# Altium project PROC154E3_SCH.PrjPcb (part 54 of 60)

## Sheet 56. SOC LDOs & LD SWITCHES.SchDoc: SOC - LDO's
size 513 x 386 mm; Project: PROC154E2(001)_SK_AM69; Issue: 1.0; RevCode: E3; Page Create Date: March  8, 1995; Variant Name: Core Design; Schematic Page Number: 56; Page Number: 56; Page Size: C; Comment: MISTRAL_TITLEBLK_CSIZE_1; Page Count: 62; Schematic Page Count: 62; Name: PROC154E2 001 SK AM69; DsnPath: C:\Users\danie\Downloads\sprr466c\PROC154E3_RP\PROC154E3_SCH.DSN; SchematicName: SCHEMATIC1; PageName: 56. SOC LDOs & LD SWITCHES; PageSize: C; TopSchematic: True
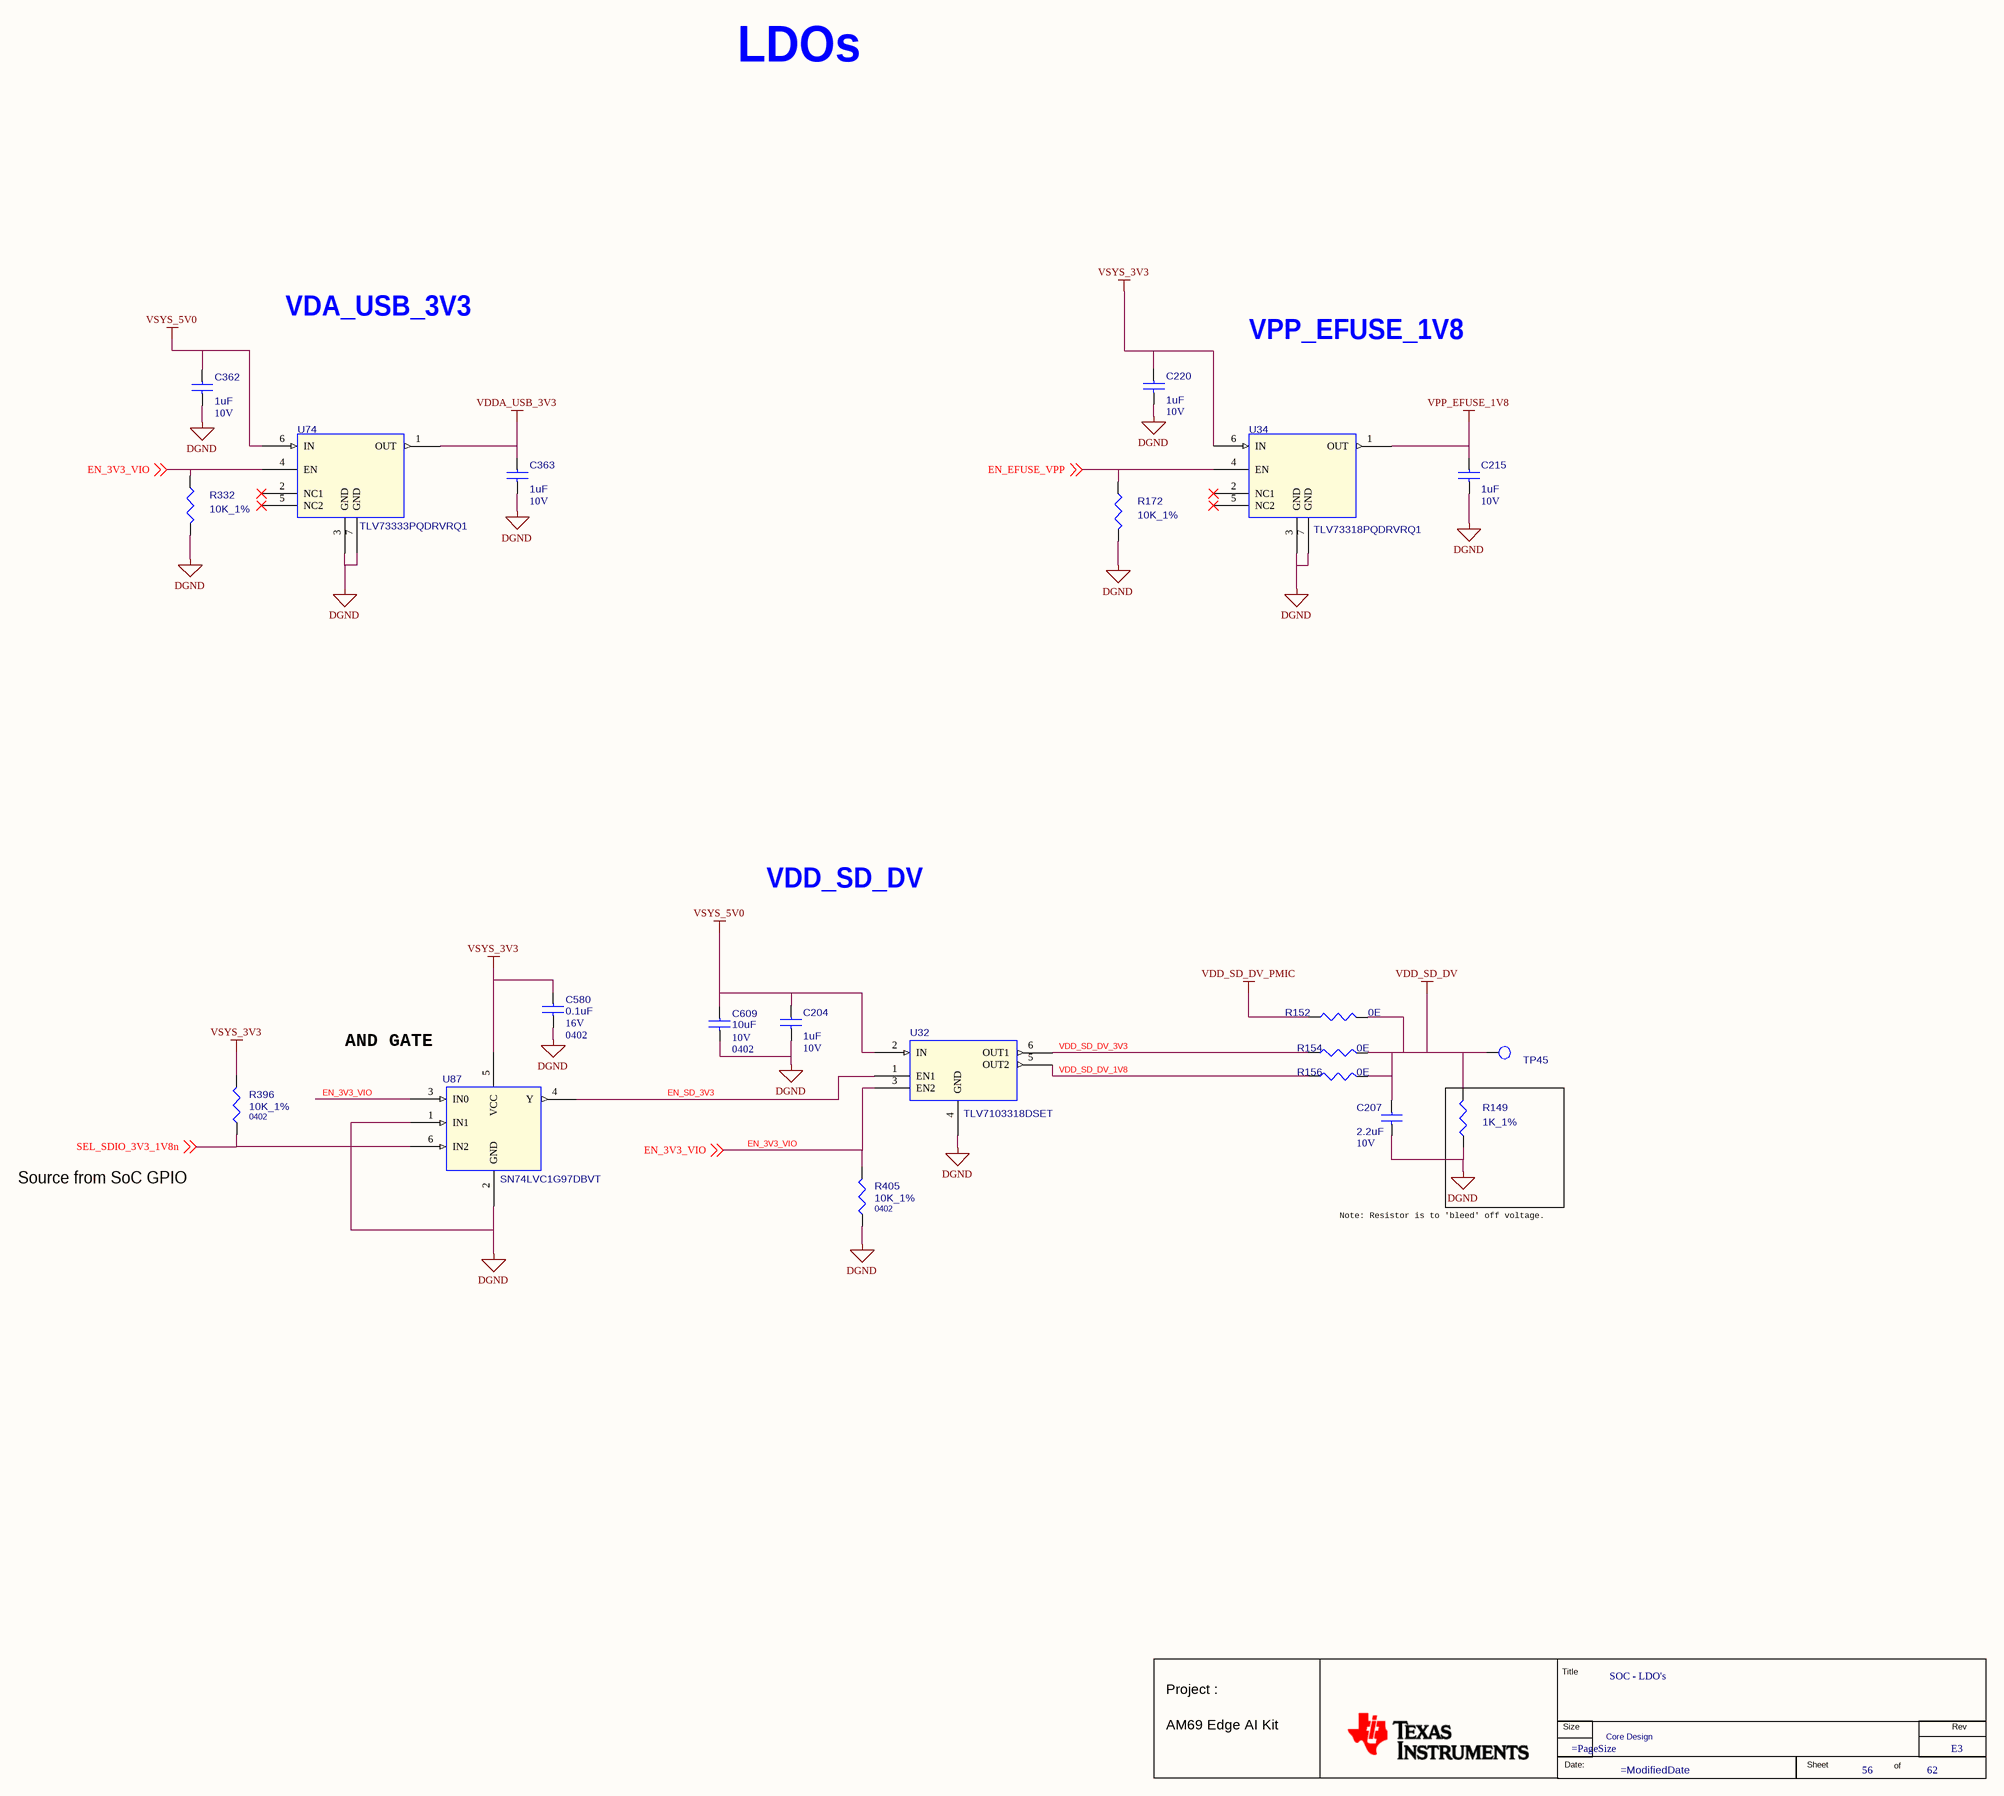
[diagram p94: 56. SOC LDOs & LD SWITCHES.SchDoc]

### Parts
(Parts that share a designator on the sheet are numbered #1, #2 ... from top to bottom, then left to right.)
*#56  RevCode: E3  Title: SOC - LDO's  Page Number: 56  Page Count: 62  Variant Name: Core Design  (hidden comment: MISTRAL_TITLEBLK_CSIZE_1)  (graphical)
C204  1uF  Voltage: 10V  [CAP0402_0-75]
C207  2.2uF  Voltage: 10V  [CAP0603_1]
C215  1uF  Voltage: 10V  [CAP0402_0-75]
C220  1uF  Voltage: 10V  [CAP0402_0-75]
C362  1uF  Voltage: 10V  [CAP0402_0-75]
C363  1uF  Voltage: 10V  [CAP0402_0-75]
C580  0.1uF  Voltage: 16V  Package: 0402  [CAP0402_0-75]
C609  10uF  Voltage: 10V  Package: 0402  [CAP0402_0-75]
R149  1K_1%  [RES0402_0-5]
R152  0E  [RES0402_0-5]
R154  0E  [RES0402_0-5]
R156  0E  [RES0402_0-5]
R172  10K_1%  [RES0402_0-5]
R332  10K_1%  [RES0402_0-5]
R396  10K_1%  Package: 0402  [RES0402_0-5]
R405  10K_1%  Package: 0402  [RES0402_0-5]
TP45  TP30_SMD  [TP30_SMD]  (value not drawn)
U32  TLV7103318DSET  [WSON6_19-68_60X60]
U34  TLV73318PQDRVRQ1  [SON6_25-59_85X85_0-8]
U74  TLV73333PQDRVRQ1  [SON6_25-59_85X85_0-8]
U87  SN74LVC1G97DBVT  [SOT23-6]

### Nets
DGND: C204.2 C207.2 C215.2 C220.2 C362.2 C363.2 C580.2 C609.2 R149.1 R172.2 R332.2 R405.1 U32.4(GND) U34.3(GND) U34.7(GND) U74.3(GND) U74.7(GND) U87.1(IN1) U87.2(GND)  [project net VDD_CPU_HCPS_GOSNS]
VDD_SD_DV: C207.1 R149.2 R152.1 R154.2 R156.2 TP45.1(TP)
VDD_SD_DV_PMIC: R152.2
VDDA_USB_3V3: C363.1 U74.1(OUT)
VPP_EFUSE_1V8: C215.1 U34.1(OUT)
VSYS_3V3: C220.1 C580.1 R396.2 U34.6(IN) U87.5(VCC)  [project net V_3V3]
VSYS_5V0: C204.1 C362.1 C609.1 U32.2(IN) U74.6(IN)
EN_3V3_VIO: R332.1 R405.2 U32.3(EN2) U74.4(EN) U87.3(IN0) ; off-sheet EN_3V3_VIO
EN_EFUSE_VPP: R172.1 U34.4(EN) ; off-sheet EN_EFUSE_VPP
EN_SD_3V3: U32.1(EN1) U87.4(Y)
SEL_SDIO_3V3_1V8n: R396.1 U87.6(IN2) ; off-sheet SEL_SDIO_3V3_1V8n
VDD_SD_DV_1V8: R156.1 U32.5(OUT2)
VDD_SD_DV_3V3: R154.1 U32.6(OUT1)

Not connected (* = marked no-connect by the designer): U34 2(NC1)* 5(NC2)*; U74 2(NC1)* 5(NC2)*

### Notes on the sheet
- LDOs
- VDA_USB_3V3
- VPP_EFUSE_1V8
- VDD_SD_DV
- (near U87) AND GATE
- Source from SoC GPIO
- Note: Resistor is to 'bleed' off voltage.
- (in symbol MISTRAL_TITLEBLK_CSIZE_1) Title; Project :; Size; Rev; AM69 Edge AI Kit; Date:; Sheet; of

### Library data of the parts
*#56 = MISTRAL_TITLEBLK_CSIZE_1: Issue: 1.0; Project: PROC154E2(001)_SK_AM69; Name: PROC154E2 001 SK AM69; Page Create Date: March  8, 1995; Page Size: =PageSize; Page Modify Date: =ModifiedDate; Schematic Page Count: 62; Schematic Page Number: 56
C204 = CAP_Dup1: CAP CERAMIC 1uF 10V 10% X7S AUTO 0402; Part Reference: C204; Mistral Part No: 120018090021-R; Mfr_name: MURATA; Mfr_part_number: GCM155C71A105KE38D; Part_type: CAPACITORS\CERAMIC; Direct Alternate_mfr_name: YAGEO AMERICA; Direct Alternate_mfr_part_number: CC0402KRX5R7BB105; Automotive Alternate_mfr_name: TAIYO YUDEN; Automotive Alternate_mfr_part_number: EMK105BJ105KVHF; Manufacturer: TDK CORPORATION; Project: SMART-M_SCRIPTALK_PB; Wattage: NA; Customs_HS_Code: 85322990; Custom_Duty: 15%; Value: 1uF; PCB Footprint: CAP0402_0-75; Footprint Path: Y:\MIS_DATABASE\Library\ALTIUM_TOOL\PCB_FOOTPRINTS\Altium_Footprint_Lib.PcbLib; Library Path: Y:\MIS_DATABASE\Library\ALTIUM_TOOL\SCHEMATICS_PARTS\MS_DISCRETE_Library.schlib; Footprint Ref: CAP0402_0-75; Tolerance: 10%; Package: 0402; Distributor_name: DIGIKEY; Distributor_part_number: 490-13409-1-ND; Height: 0.70MM; Weight: 6mg; Temperature: -55°C+125°C; Datasheet: Y:\MIS_DATABASE\DATASHEETS\CAPACITORS\MURATA-GCM-SER.PDF; Crtd /date: ALVY/100918; Chkd/date: MANIRAJA/100918; Library Ref: CAP; MECHANICAL 3D STEP FILE: CAP0402_0-75
C207 = CAP_Dup1: CAP CERAMIC 2.2uF 10V 10% X7S 0603; Part Reference: C207; Manufacturer: MURATA; Automotive Alternate_mfr_part_number: LMK105ABJ225MVHF; Automotive Alternate_mfr_name: TAIYO YUDEN; Direct Alternate_mfr_part_number: C1005X5R1A225K050BC; Direct Alternate_mfr_name: TDK; Part_type: CAPACITORS\CERAMIC; Mfr_part_number: GCM188C71A225KE01; Mistral Part No: 120022090022-R; Custom_Duty: 15%; Customs_HS_Code: 85322990; Wattage: NA; Project: J7AHP_SK_BRD; Value: 2.2uF; PCB Footprint: CAP0603_1; Footprint Path: Y:\MIS_DATABASE\Library\ALTIUM_TOOL\PCB_FOOTPRINTS\Altium_Footprint_Lib.PcbLib; Library Path: Y:\MIS_DATABASE\Library\ALTIUM_TOOL\SCHEMATICS_PARTS\MS_DISCRETE_Library.schlib; Footprint Ref: CAP0603_1; Library Ref: CAP; MECHANICAL 3D STEP FILE: CAP0603_1; Chkd/date: PRAVEEN/160922; Crtd /date: PRAVEEN/160922; Datasheet: Y:\MIS_DATABASE\DATASHEETS\CAPACITORS\GCM188C71A225KE01.PDF; Temperature: -55°C+125°C; Weight: 6.3mg; Height: 0.90MM; Distributor_part_number: NA; Distributor_name: NA; Package: 0603; Tolerance: 10%; Mfr_name: MURATA
C215 = CAP_Dup1: CAP CERAMIC 1uF 10V 10% X7S AUTO 0402; Part Reference: C215; Mistral Part No: 120018090021-R; Mfr_name: MURATA; Mfr_part_number: GCM155C71A105KE38D; Part_type: CAPACITORS\CERAMIC; Direct Alternate_mfr_name: YAGEO AMERICA; Direct Alternate_mfr_part_number: CC0402KRX5R7BB105; Automotive Alternate_mfr_name: TAIYO YUDEN; Automotive Alternate_mfr_part_number: EMK105BJ105KVHF; Manufacturer: TDK CORPORATION; Project: SMART-M_SCRIPTALK_PB; Wattage: NA; Customs_HS_Code: 85322990; Custom_Duty: 15%; Value: 1uF; PCB Footprint: CAP0402_0-75; Footprint Path: Y:\MIS_DATABASE\Library\ALTIUM_TOOL\PCB_FOOTPRINTS\Altium_Footprint_Lib.PcbLib; Library Path: Y:\MIS_DATABASE\Library\ALTIUM_TOOL\SCHEMATICS_PARTS\MS_DISCRETE_Library.schlib; Footprint Ref: CAP0402_0-75; Tolerance: 10%; Package: 0402; Distributor_name: DIGIKEY; Distributor_part_number: 490-13409-1-ND; Height: 0.70MM; Weight: 6mg; Temperature: -55°C+125°C; Datasheet: Y:\MIS_DATABASE\DATASHEETS\CAPACITORS\MURATA-GCM-SER.PDF; Crtd /date: ALVY/100918; Chkd/date: MANIRAJA/100918; Library Ref: CAP; MECHANICAL 3D STEP FILE: CAP0402_0-75
C220 = CAP_Dup1: CAP CERAMIC 1uF 10V 10% X7S AUTO 0402; Part Reference: C220; Mistral Part No: 120018090021-R; Mfr_name: MURATA; Mfr_part_number: GCM155C71A105KE38D; Part_type: CAPACITORS\CERAMIC; Direct Alternate_mfr_name: YAGEO AMERICA; Direct Alternate_mfr_part_number: CC0402KRX5R7BB105; Automotive Alternate_mfr_name: TAIYO YUDEN; Automotive Alternate_mfr_part_number: EMK105BJ105KVHF; Manufacturer: TDK CORPORATION; Project: SMART-M_SCRIPTALK_PB; Wattage: NA; Customs_HS_Code: 85322990; Custom_Duty: 15%; Value: 1uF; PCB Footprint: CAP0402_0-75; Footprint Path: Y:\MIS_DATABASE\Library\ALTIUM_TOOL\PCB_FOOTPRINTS\Altium_Footprint_Lib.PcbLib; Library Path: Y:\MIS_DATABASE\Library\ALTIUM_TOOL\SCHEMATICS_PARTS\MS_DISCRETE_Library.schlib; Footprint Ref: CAP0402_0-75; Tolerance: 10%; Package: 0402; Distributor_name: DIGIKEY; Distributor_part_number: 490-13409-1-ND; Height: 0.70MM; Weight: 6mg; Temperature: -55°C+125°C; Datasheet: Y:\MIS_DATABASE\DATASHEETS\CAPACITORS\MURATA-GCM-SER.PDF; Crtd /date: ALVY/100918; Chkd/date: MANIRAJA/100918; Library Ref: CAP; MECHANICAL 3D STEP FILE: CAP0402_0-75
C362 = CAP_Dup1: CAP CERAMIC 1uF 10V 10% X7S AUTO 0402; Part Reference: C362; Manufacturer: TDK CORPORATION; Automotive Alternate_mfr_part_number: EMK105BJ105KVHF; Automotive Alternate_mfr_name: TAIYO YUDEN; Direct Alternate_mfr_part_number: CC0402KRX5R7BB105; Direct Alternate_mfr_name: YAGEO AMERICA; Part_type: CAPACITORS\CERAMIC; Mfr_part_number: GCM155C71A105KE38D; Mfr_name: MURATA; Mistral Part No: 120018090021-R; Custom_Duty: 15%; Customs_HS_Code: 85322990; Wattage: NA; Project: SMART-M_SCRIPTALK_PB; Value: 1uF; PCB Footprint: CAP0402_0-75; MECHANICAL 3D STEP FILE: CAP0402_0-75; Library Ref: CAP; Chkd/date: MANIRAJA/100918; Crtd /date: ALVY/100918; Datasheet: Y:\MIS_DATABASE\DATASHEETS\CAPACITORS\MURATA-GCM-SER.PDF; Temperature: -55°C+125°C; Weight: 6mg; Height: 0.70MM; Distributor_part_number: 490-13409-1-ND; Distributor_name: DIGIKEY; Package: 0402; Tolerance: 10%; Footprint Ref: CAP0402_0-75; Library Path: Y:\MIS_DATABASE\Library\ALTIUM_TOOL\SCHEMATICS_PARTS\MS_DISCRETE_Library.schlib; Footprint Path: Y:\MIS_DATABASE\Library\ALTIUM_TOOL\PCB_FOOTPRINTS\Altium_Footprint_Lib.PcbLib
C363 = CAP_Dup1: CAP CERAMIC 1uF 10V 10% X7S AUTO 0402; Part Reference: C363; Mistral Part No: 120018090021-R; Mfr_name: MURATA; Mfr_part_number: GCM155C71A105KE38D; Part_type: CAPACITORS\CERAMIC; Direct Alternate_mfr_name: YAGEO AMERICA; Direct Alternate_mfr_part_number: CC0402KRX5R7BB105; Automotive Alternate_mfr_name: TAIYO YUDEN; Automotive Alternate_mfr_part_number: EMK105BJ105KVHF; Manufacturer: TDK CORPORATION; Project: SMART-M_SCRIPTALK_PB; Wattage: NA; Customs_HS_Code: 85322990; Custom_Duty: 15%; Value: 1uF; PCB Footprint: CAP0402_0-75; Footprint Path: Y:\MIS_DATABASE\Library\ALTIUM_TOOL\PCB_FOOTPRINTS\Altium_Footprint_Lib.PcbLib; Library Path: Y:\MIS_DATABASE\Library\ALTIUM_TOOL\SCHEMATICS_PARTS\MS_DISCRETE_Library.schlib; Footprint Ref: CAP0402_0-75; Tolerance: 10%; Package: 0402; Distributor_name: DIGIKEY; Distributor_part_number: 490-13409-1-ND; Height: 0.70MM; Weight: 6mg; Temperature: -55°C+125°C; Datasheet: Y:\MIS_DATABASE\DATASHEETS\CAPACITORS\MURATA-GCM-SER.PDF; Crtd /date: ALVY/100918; Chkd/date: MANIRAJA/100918; Library Ref: CAP; MECHANICAL 3D STEP FILE: CAP0402_0-75
C580 = CAP_Dup1: CAP CERAMIC 0.1uF 16V 10% X7R AUTO 0402; Part Reference: C580; Mistral Part No: 120016070006-R; Mfr_name: MURATA; Mfr_part_number: GCM155R71C104KA55D; Part_type: CAPACITORS\CERAMIC; Direct Alternate_mfr_part_number: GCM155R71C104JA55D; Automotive Alternate_mfr_name: TDK; Automotive Alternate_mfr_part_number: CGA2B1X7R1C104K050BC; Project: DCMIST_FPGA_CARD; Wattage: NA; Customs_HS_Code: 85322990; Custom_Duty: 15%; Value: 0.1uF; PCB Footprint: CAP0402_0-75; Footprint Ref: CAP0402_0-75; Tolerance: 10%; Distributor_name: DIGIKEY; Distributor_part_number: 490-4759-1-ND; Library Ref: CAP; Height: 0.55MM; Weight: 6mg; Temperature: -55°C+125°C; Datasheet: Y:\MIS_DATABASE\DATASHEETS\CAPACITORS\MURATA-GCM-SER.PDF; Crtd /date: VASANTHA/300514; Chkd/date: NAVEED/021014; MECHANICAL 3D STEP FILE: CAP0402_0-75; Library Path: Y:\MIS_DATABASE\Library\ALTIUM_TOOL\SCHEMATICS_PARTS\MS_DISCRETE_Library.schlib; Footprint Path: Y:\MIS_DATABASE\Library\ALTIUM_TOOL\PCB_FOOTPRINTS\Altium_Footprint_Lib.PcbLib; Direct Alternate_mfr_name: MURATA; Manufacturer: MURATA
C609 = CAP_Dup1: CAP CERAMIC 10uF 10V 20% X5R 0402; Part Reference: C609; Manufacturer: MURATA; Mistral Part No: 120013110019-R; Mfr_part_number: GRM155R61A106ME11D; Part_type: CAPACITORS\CERAMIC; Project: QCS610_NANOSOM; Wattage: NA; Customs_HS_Code: 85322990; Custom_Duty: 15%; Value: 10uF; PCB Footprint: CAP0402_0-75; Footprint Ref: CAP0402_0-75; Mfr_name: MURATA; Tolerance: 20%; Distributor_name: DIGIKEY; Distributor_part_number: 490-GRM155R61A106ME11DTR-ND; Library Ref: CAP; Height: 0.55MM; Weight: 3.1mg; Temperature: -55°C+85°C; Datasheet: Y:\MIS_DATABASE\DATASHEETS\CAPACITORS\MURATA-GXX-SER_NOV17.PDF; Crtd /date: ALVY/260520; Chkd/date: MANIRAJA/300520; MECHANICAL 3D STEP FILE: CAP0402_0-75; Library Path: Y:\MIS_DATABASE\Library\ALTIUM_TOOL\SCHEMATICS_PARTS\MS_DISCRETE_Library.schlib; Footprint Path: Y:\MIS_DATABASE\Library\ALTIUM_TOOL\PCB_FOOTPRINTS\Altium_Footprint_Lib.PcbLib
R149 = RESISTOR_Dup2: RES 1K 1/10W 1% 0402; Part Reference: R149; Part_type: RESISTORS\FIXED; Mfr_part_number: ERJ-2RKF1001X; Mfr_name: PANASONIC-ECG; Mistral Part No: 110009030411-R; Voltage: NA; Project: VOCERA; Customs_HS_Code: 85332119; Custom_Duty: 15%; Value: 1K_1%; PCB Footprint: RES0402_0-5; Footprint Path: Y:\MIS_DATABASE\Library\ALTIUM_TOOL\PCB_FOOTPRINTS\Altium_Footprint_Lib.PcbLib; Crtd /date: MAZHAR/150506; Datasheet: Y:\MIS_DATABASE\DATASHEETS\RESISTORS\PAN-ERJSER_NOV17.PDF; Temperature: -55°C+155°C; Weight: 0.8mg; Height: 0.40MM; Distributor_part_number: P1.00KLCT-ND; Distributor_name: DIGIKEY; Package: 0402; Wattage: 1/10W; Tolerance: 1%; Library Ref: RESISTOR; Footprint Ref: RES0402_0-5; Chkd/date: VASANTHA/281216; MECHANICAL 3D STEP FILE: RES0402_0-5; Library Path: Y:\MIS_DATABASE\Library\ALTIUM_TOOL\SCHEMATICS_PARTS\MS_DISCRETE_Library.schlib; Manufacturer: PANASONIC-ECG
R152 = RESISTOR_Dup2: RES 0E 1/10W JUMPER 0402; Part Reference: R152; Manufacturer: PANASONIC-ECG; Mistral Part No: 110018030052-R; Mfr_part_number: ERJ-2GE0R00X; Part_type: RESISTORS\FIXED; IBISSP_MODLES: VALUE REPEATING 2 TIME; Project: AEGIS POM; Tolerance: NA; Customs_HS_Code: 85332119; Custom_Duty: 15%; Value: 0E; PCB Footprint: RES0402_0-5; Footprint Path: Y:\MIS_DATABASE\Library\ALTIUM_TOOL\PCB_FOOTPRINTS\Altium_Footprint_Lib.PcbLib; Library Path: Y:\MIS_DATABASE\Library\ALTIUM_TOOL\SCHEMATICS_PARTS\MS_DISCRETE_Library.schlib; Mfr_name: PANASONIC-ECG; Voltage: NA; Wattage: 1/10W; Package: 0402; Distributor_name: DIGIKEY; Distributor_part_number: P0.0JCT-ND; Height: 0.40MM; Weight: 0.8mg; Temperature: -55°C+155°C; Datasheet: Y:\MIS_DATABASE\DATASHEETS\RESISTORS\PAN-ERJSER_NOV17.PDF; Crtd /date: NAVEED/201014; Chkd/date: VASANTHA/061216; MECHANICAL 3D STEP FILE: RES0402_0-5; Library Ref: RESISTOR; Footprint Ref: RES0402_0-5
R154 = RESISTOR_Dup2: RES 0E 1/10W JUMPER 0402; Part Reference: R154; Part_type: RESISTORS\FIXED; Mfr_part_number: ERJ-2GE0R00X; Mfr_name: PANASONIC-ECG; Mistral Part No: 110018030052-R; Custom_Duty: 15%; Customs_HS_Code: 85332119; Voltage: NA; Project: AEGIS POM; IBISSP_MODLES: VALUE REPEATING 2 TIME; Value: 0E; PCB Footprint: RES0402_0-5; Footprint Ref: RES0402_0-5; Library Ref: RESISTOR; MECHANICAL 3D STEP FILE: RES0402_0-5; Chkd/date: VASANTHA/061216; Crtd /date: NAVEED/201014; Datasheet: Y:\MIS_DATABASE\DATASHEETS\RESISTORS\PAN-ERJSER_NOV17.PDF; Temperature: -55°C+155°C; Weight: 0.8mg; Height: 0.40MM; Distributor_part_number: P0.0JCT-ND; Distributor_name: DIGIKEY; Package: 0402; Wattage: 1/10W; Tolerance: NA; Library Path: Y:\MIS_DATABASE\Library\ALTIUM_TOOL\SCHEMATICS_PARTS\MS_DISCRETE_Library.schlib; Footprint Path: Y:\MIS_DATABASE\Library\ALTIUM_TOOL\PCB_FOOTPRINTS\Altium_Footprint_Lib.PcbLib; Manufacturer: PANASONIC-ECG
R156 = RESISTOR_Dup2: RES 0E 1/10W JUMPER 0402; Part Reference: R156; Mistral Part No: 110018030052-R; Mfr_name: PANASONIC-ECG; Mfr_part_number: ERJ-2GE0R00X; Part_type: RESISTORS\FIXED; Project: AEGIS POM; Tolerance: NA; Customs_HS_Code: 85332119; Custom_Duty: 15%; IBISSP_MODLES: VALUE REPEATING 2 TIME; Value: 0E; PCB Footprint: RES0402_0-5; Footprint Path: Y:\MIS_DATABASE\Library\ALTIUM_TOOL\PCB_FOOTPRINTS\Altium_Footprint_Lib.PcbLib; Library Path: Y:\MIS_DATABASE\Library\ALTIUM_TOOL\SCHEMATICS_PARTS\MS_DISCRETE_Library.schlib; Voltage: NA; Wattage: 1/10W; Package: 0402; Distributor_name: DIGIKEY; Distributor_part_number: P0.0JCT-ND; Height: 0.40MM; Weight: 0.8mg; Temperature: -55°C+155°C; Datasheet: Y:\MIS_DATABASE\DATASHEETS\RESISTORS\PAN-ERJSER_NOV17.PDF; Crtd /date: NAVEED/201014; Chkd/date: VASANTHA/061216; MECHANICAL 3D STEP FILE: RES0402_0-5; Library Ref: RESISTOR; Footprint Ref: RES0402_0-5; Manufacturer: PANASONIC-ECG
R172 = RESISTOR_Dup2: RES 10K 1/16W 1% 0402; Part Reference: R172; Mistral Part No: 110015090015-R; Mfr_name: YAGEO AMERICA; Mfr_part_number: RC0402FR-0710KL; Part_type: RESISTORS\FIXED; Project: VOCERA; Voltage: NA; Customs_HS_Code: 85332119; Custom_Duty: 15%; Value: 10K_1%; PCB Footprint: RES0402_0-5; Footprint Ref: RES0402_0-5; Tolerance: 1%; Wattage: 1/16W; Package: 0402; Distributor_name: DIGIKEY; Distributor_part_number: 311-10.0KLRTR-ND; Library Ref: RESISTOR; Height: 0.40MM; Weight: 0.65mg; Temperature: -55°C+155°C; Datasheet: Y:\MIS_DATABASE\DATASHEETS\RESISTORS\RCXXXXL-SER_MAR18.PDF; Crtd /date: GEETHA/290506; Chkd/date: VASANTHA/201216; MECHANICAL 3D STEP FILE: RES0402_0-5; Library Path: Y:\MIS_DATABASE\Library\ALTIUM_TOOL\SCHEMATICS_PARTS\MS_DISCRETE_Library.schlib; Footprint Path: Y:\MIS_DATABASE\Library\ALTIUM_TOOL\PCB_FOOTPRINTS\Altium_Footprint_Lib.PcbLib; Manufacturer: YAGEO AMERICA
R332 = RESISTOR_Dup2: RES 10K 1/16W 1% 0402; Part Reference: R332; Part_type: RESISTORS\FIXED; Mfr_part_number: RC0402FR-0710KL; Mfr_name: YAGEO AMERICA; Mistral Part No: 110015090015-R; Custom_Duty: 15%; Customs_HS_Code: 85332119; Voltage: NA; Project: VOCERA; Value: 10K_1%; PCB Footprint: RES0402_0-5; Footprint Path: Y:\MIS_DATABASE\Library\ALTIUM_TOOL\PCB_FOOTPRINTS\Altium_Footprint_Lib.PcbLib; Library Path: Y:\MIS_DATABASE\Library\ALTIUM_TOOL\SCHEMATICS_PARTS\MS_DISCRETE_Library.schlib; MECHANICAL 3D STEP FILE: RES0402_0-5; Chkd/date: VASANTHA/201216; Crtd /date: GEETHA/290506; Datasheet: Y:\MIS_DATABASE\DATASHEETS\RESISTORS\RCXXXXL-SER_MAR18.PDF; Temperature: -55°C+155°C; Weight: 0.65mg; Height: 0.40MM; Library Ref: RESISTOR; Distributor_part_number: 311-10.0KLRTR-ND; Distributor_name: DIGIKEY; Package: 0402; Wattage: 1/16W; Tolerance: 1%; Footprint Ref: RES0402_0-5; Manufacturer: YAGEO AMERICA
R396 = RESISTOR_Dup2: RES 10K 1/16W 1% 0402; Part Reference: R396; Part_type: RESISTORS\FIXED; Mfr_part_number: RC0402FR-0710KL; Mfr_name: YAGEO AMERICA; Mistral Part No: 110015090015-R; Custom_Duty: 15%; Customs_HS_Code: 85332119; Voltage: NA; Project: VOCERA; Value: 10K_1%; PCB Footprint: RES0402_0-5; Footprint Path: Y:\MIS_DATABASE\Library\ALTIUM_TOOL\PCB_FOOTPRINTS\Altium_Footprint_Lib.PcbLib; Library Path: Y:\MIS_DATABASE\Library\ALTIUM_TOOL\SCHEMATICS_PARTS\MS_DISCRETE_Library.schlib; MECHANICAL 3D STEP FILE: RES0402_0-5; Chkd/date: VASANTHA/201216; Crtd /date: GEETHA/290506; Datasheet: Y:\MIS_DATABASE\DATASHEETS\RESISTORS\RCXXXXL-SER_MAR18.PDF; Temperature: -55°C+155°C; Weight: 0.65mg; Height: 0.40MM; Library Ref: RESISTOR; Distributor_part_number: 311-10.0KLRTR-ND; Distributor_name: DIGIKEY; Wattage: 1/16W; Tolerance: 1%; Footprint Ref: RES0402_0-5; Manufacturer: YAGEO AMERICA
R405 = RESISTOR_Dup2: RES 10K 1/16W 1% 0402; Part Reference: R405; Mistral Part No: 110015090015-R; Mfr_name: YAGEO AMERICA; Mfr_part_number: RC0402FR-0710KL; Part_type: RESISTORS\FIXED; Project: VOCERA; Voltage: NA; Customs_HS_Code: 85332119; Custom_Duty: 15%; Value: 10K_1%; PCB Footprint: RES0402_0-5; Footprint Ref: RES0402_0-5; Tolerance: 1%; Wattage: 1/16W; Distributor_name: DIGIKEY; Distributor_part_number: 311-10.0KLRTR-ND; Library Ref: RESISTOR; Height: 0.40MM; Weight: 0.65mg; Temperature: -55°C+155°C; Datasheet: Y:\MIS_DATABASE\DATASHEETS\RESISTORS\RCXXXXL-SER_MAR18.PDF; Crtd /date: GEETHA/290506; Chkd/date: VASANTHA/201216; MECHANICAL 3D STEP FILE: RES0402_0-5; Library Path: Y:\MIS_DATABASE\Library\ALTIUM_TOOL\SCHEMATICS_PARTS\MS_DISCRETE_Library.schlib; Footprint Path: Y:\MIS_DATABASE\Library\ALTIUM_TOOL\PCB_FOOTPRINTS\Altium_Footprint_Lib.PcbLib; Manufacturer: YAGEO AMERICA
TP45 = TESTPOINT_Dup1: TESTPOINT CIR 30 SMD; Part Reference: TP45; Mistral Part No: 130009030930; Mfr_name: LOCAL; Project: BT MODULE_CSRBC04; Tolerance: NA; Value: TP30_SMD; PCB Footprint: TP30_SMD; Footprint Ref: TP30_SMD; Mfr_part_number: TP30_SMD; Part_type: TESTPOINT; Voltage: NA; Wattage: NA; Package: SMD; Distributor_name: NA; Distributor_part_number: NA; Library Ref: TESTPOINT; Height: NA; Weight: NA; Temperature: NA; Datasheet: NA; Crtd /date: MAZHAR/171006; Chkd/date: SHREESHAIL/171006; RoHS: NA; Customs_HS_Code: NA; Custom_Duty: NA; MECHANICAL 3D STEP FILE: NA; Library Path: Y:\MIS_DATABASE\Library\ALTIUM_TOOL\SCHEMATICS_PARTS\MS_DISCRETE_Library.schlib; Footprint Path: Y:\MIS_DATABASE\Library\ALTIUM_TOOL\PCB_FOOTPRINTS\Altium_Footprint_Lib.PcbLib; Manufacturer: LOCAL
U32 = TLV7103318D_WSON6: IC REGULATOR LDO LINEAR 200mA WSON6; Part Reference: U32; Mistral Part No: 142015030017-R; Mfr_name: TEXAS INSTRUMENTS; Part_type: ICS\POWER\VOLTAGE REGULATOR; Automotive Alternate_mfr_part_number: TLV7103318QDSERQ1; Project: DUET BOARDS; Tolerance: NA; Customs_HS_Code: 85423100; Custom_Duty: 15%; Value: TLV7103318DSET; PCB Footprint: WSON6_19-68_60X60; Mfr_part_number: TLV7103318DSET; Voltage: NA; Wattage: NA; Package: WSON6; Distributor_name: DIGIKEY; Distributor_part_number: 296-29058-1-ND; Library Ref: TLV7103318D_WSON6; Height: 0.80MM; Weight: NA; Temperature: -40°C+125°C; Datasheet: Y:\MIS_DATABASE\DATASHEETS\MISC\REGULATORS\TLV71-SER.PDF; Crtd /date: JEBRAN/300315; Chkd/date: NAVEED/080415; Automotive Alternate_mfr_name: TEXAS INSTRUMENTS; Manufacturer: TEXAS INSTRUMENTS
U34 = TLV733P-Q1_WSON6: IC 1.8V 300mA CAPACITOR-FREE LDO LINEAR REGULATOR WSON6; Part Reference: U34; Manufacturer: TEXAS INSTRUMENTS; Mistral Part No: 142021040008-R; Part_type: ICS\POWER\VOLTAGE REGULATOR; Project: TI_J7AEP_EVM_SOM; Tolerance: NA; Customs_HS_Code: 85423100; Custom_Duty: 15%; Value: TLV73318PQDRVRQ1; PCB Footprint: SON6_25-59_85X85_0-8; Footprint Ref: SON6_25-59_85X85_0-8; Mfr_name: TEXAS INSTRUMENTS; Mfr_part_number: TLV73318PQDRVRQ1; Voltage: NA; Wattage: NA; Package: WSON6; Distributor_name: DIGIKEY; Distributor_part_number: 296-44836-1-ND; Library Ref: TLV733P-Q1_WSON6; Height: 0.80MM; Weight: 8.5mg; Temperature: -40°C+150°C; Datasheet: Y:\MIS_DATABASE\DATASHEETS\ICS\POWER\TLV733P-Q1_OCT20.PDF; Crtd /date: ALVY/140421; Chkd/date: MANIRAJA/140421; MECHANICAL 3D STEP FILE: SON6_25-59_85X85_0-8; Library Path: Y:\MIS_DATABASE\Library\ALTIUM_TOOL\SCHEMATICS_PARTS\MS_MISCPOWER_Library.schlib; Footprint Path: Y:\MIS_DATABASE\Library\ALTIUM_TOOL\PCB_FOOTPRINTS\Altium_Footprint_Lib.PcbLib
U74 = TLV733P-Q1_WSON6: IC 3.3V 300mA CAPACITOR-FREE LDO LINEAR REGULATOR WSON6; Part Reference: U74; Manufacturer: TEXAS INSTRUMENTS; Mistral Part No: 142021040009-R; Part_type: ICS\POWER\VOLTAGE REGULATOR; Project: TI_J7AEP_EVM_SOM; Tolerance: NA; Customs_HS_Code: 85423100; Custom_Duty: 15%; Value: TLV73333PQDRVRQ1; PCB Footprint: SON6_25-59_85X85_0-8; Footprint Ref: SON6_25-59_85X85_0-8; Mfr_name: TEXAS INSTRUMENTS; Mfr_part_number: TLV73333PQDRVRQ1; Voltage: NA; Wattage: NA; Package: WSON6; Distributor_name: DIGIKEY; Distributor_part_number: 296-44839-1-ND; Library Ref: TLV733P-Q1_WSON6; Height: 0.80MM; Weight: 8.5mg; Temperature: -40°C+150°C; Datasheet: Y:\MIS_DATABASE\DATASHEETS\ICS\POWER\TLV733P-Q1_OCT20.PDF; Crtd /date: ALVY/140421; Chkd/date: MANIRAJA/140421; MECHANICAL 3D STEP FILE: SON6_25-59_85X85_0-8; Library Path: Y:\MIS_DATABASE\Library\ALTIUM_TOOL\SCHEMATICS_PARTS\MS_MISCPOWER_Library.schlib; Footprint Path: Y:\MIS_DATABASE\Library\ALTIUM_TOOL\PCB_FOOTPRINTS\Altium_Footprint_Lib.PcbLib
U87 = SN74LVC1G97DBVT_SOT23-6: IC CONFIGURABLE MULTIPLE-FUNCTION GATE SOT23-6; Part Reference: U87; Mistral Part No: 141015030002-R; Mfr_name: TEXAS INSTRUMENTS; Part_type: ICS\DIGITAL\FLIP-FLOP; Project: MEDCARDPH1; Tolerance: NA; Customs_HS_Code: 85423100; Custom_Duty: 15%; Value: SN74LVC1G97DBVT; PCB Footprint: SOT23-6; Mfr_part_number: SN74LVC1G97DBVT; Voltage: NA; Wattage: NA; Package: SOT23-6; Distributor_name: DIGIKEY; Distributor_part_number: SN74LVC1G97DBVT-ND; Library Ref: SN74LVC1G97DBVT_SOT23-6; Height: 1.45MM; Weight: NA; Temperature: -40°C+125°C; Datasheet: Y:\MIS_DATABASE\DATASHEETS\ICS\DIGITAL\GATES\SN74LVC1G97.PDF; Crtd /date: VASANTHA/180314; Chkd/date: NAVEED/130715

## Sheet 57. EVM SOC CURRENT_SENSE_RES.SchDoc: SOC - CURRENT SENSE RESISTORS
size 513 x 386 mm; Project: PROC154E2(001)_SK_AM69; Issue: 1.0; RevCode: E3; Page Create Date: March  8, 1995; Variant Name: Core Design; Schematic Page Number: 57; Page Number: 57; Page Size: C; Comment: MISTRAL_TITLEBLK_CSIZE_1; Page Count: 62; Schematic Page Count: 62; Name: PROC154E2 001 SK AM69; DsnPath: C:\Users\danie\Downloads\sprr466c\PROC154E3_RP\PROC154E3_SCH.DSN; SchematicName: SCHEMATIC1; PageName: 57. EVM SOC CURRENT_SENSE_RES; PageSize: C; TopSchematic: True
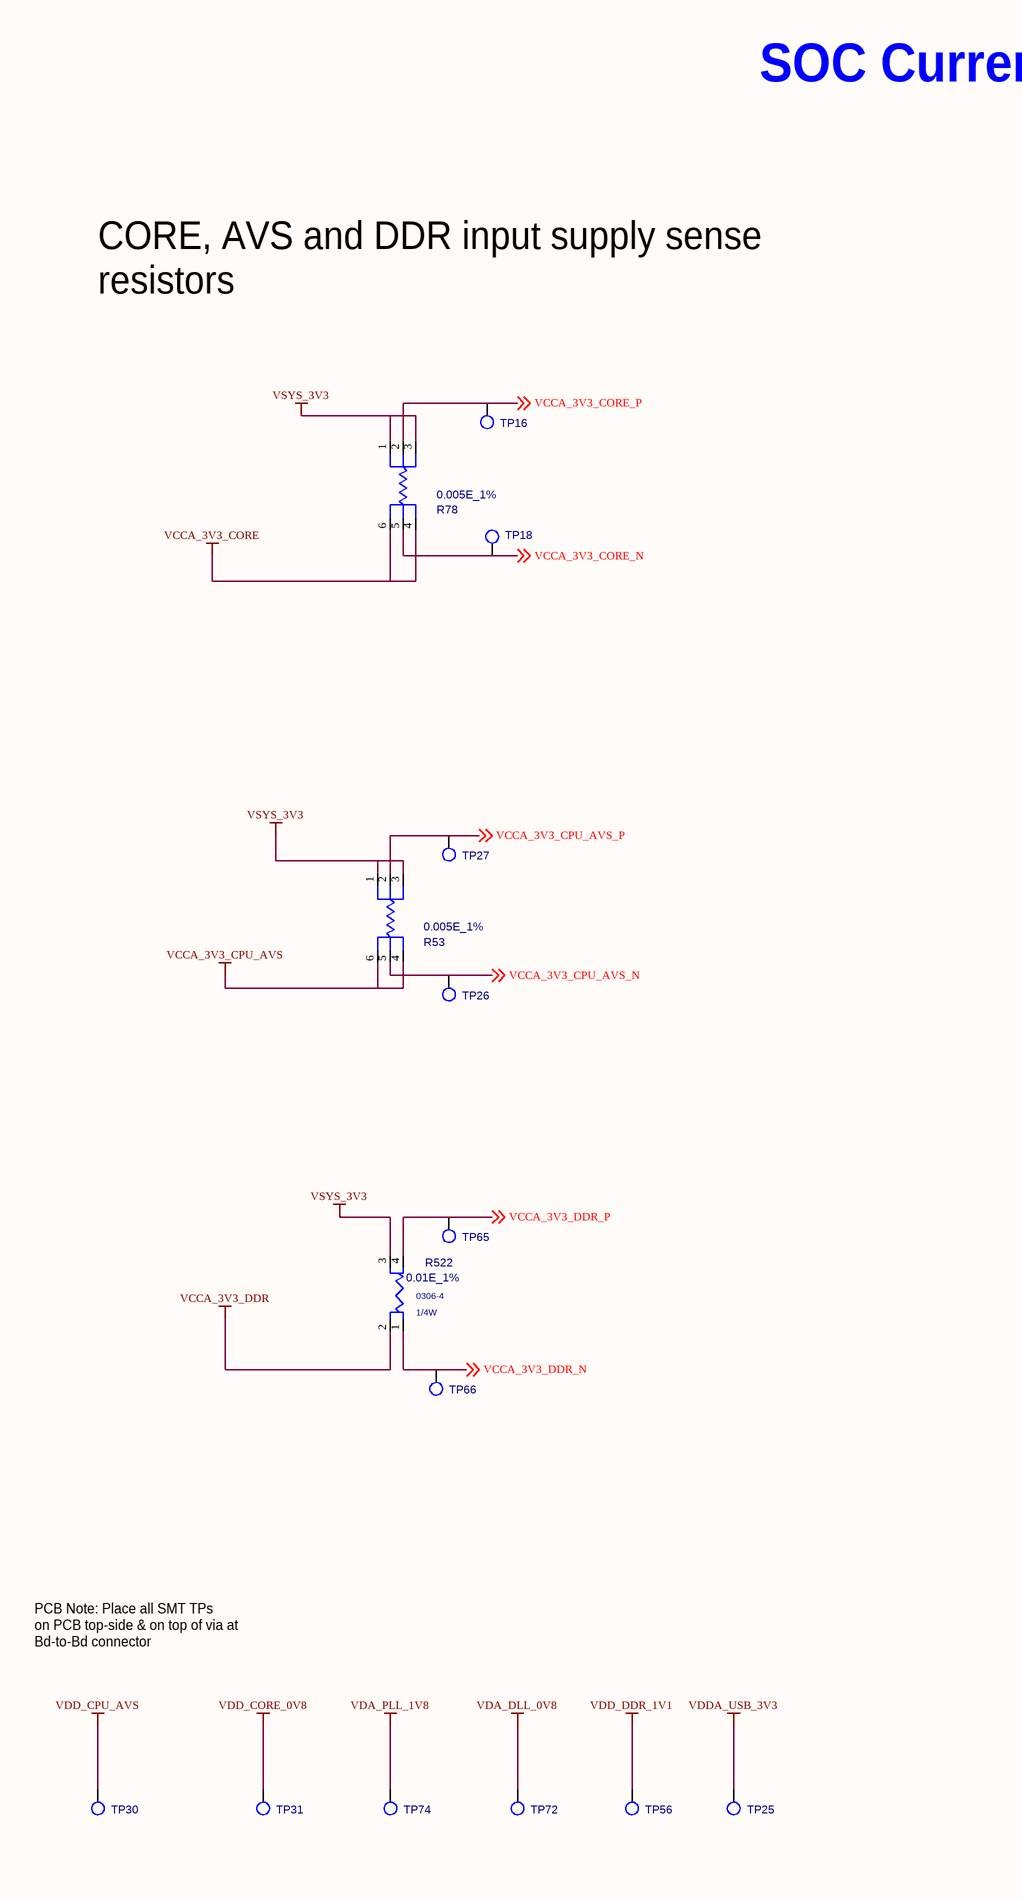
[diagram p95: 57. EVM SOC CURRENT_SENSE_RES.SchDoc, left]
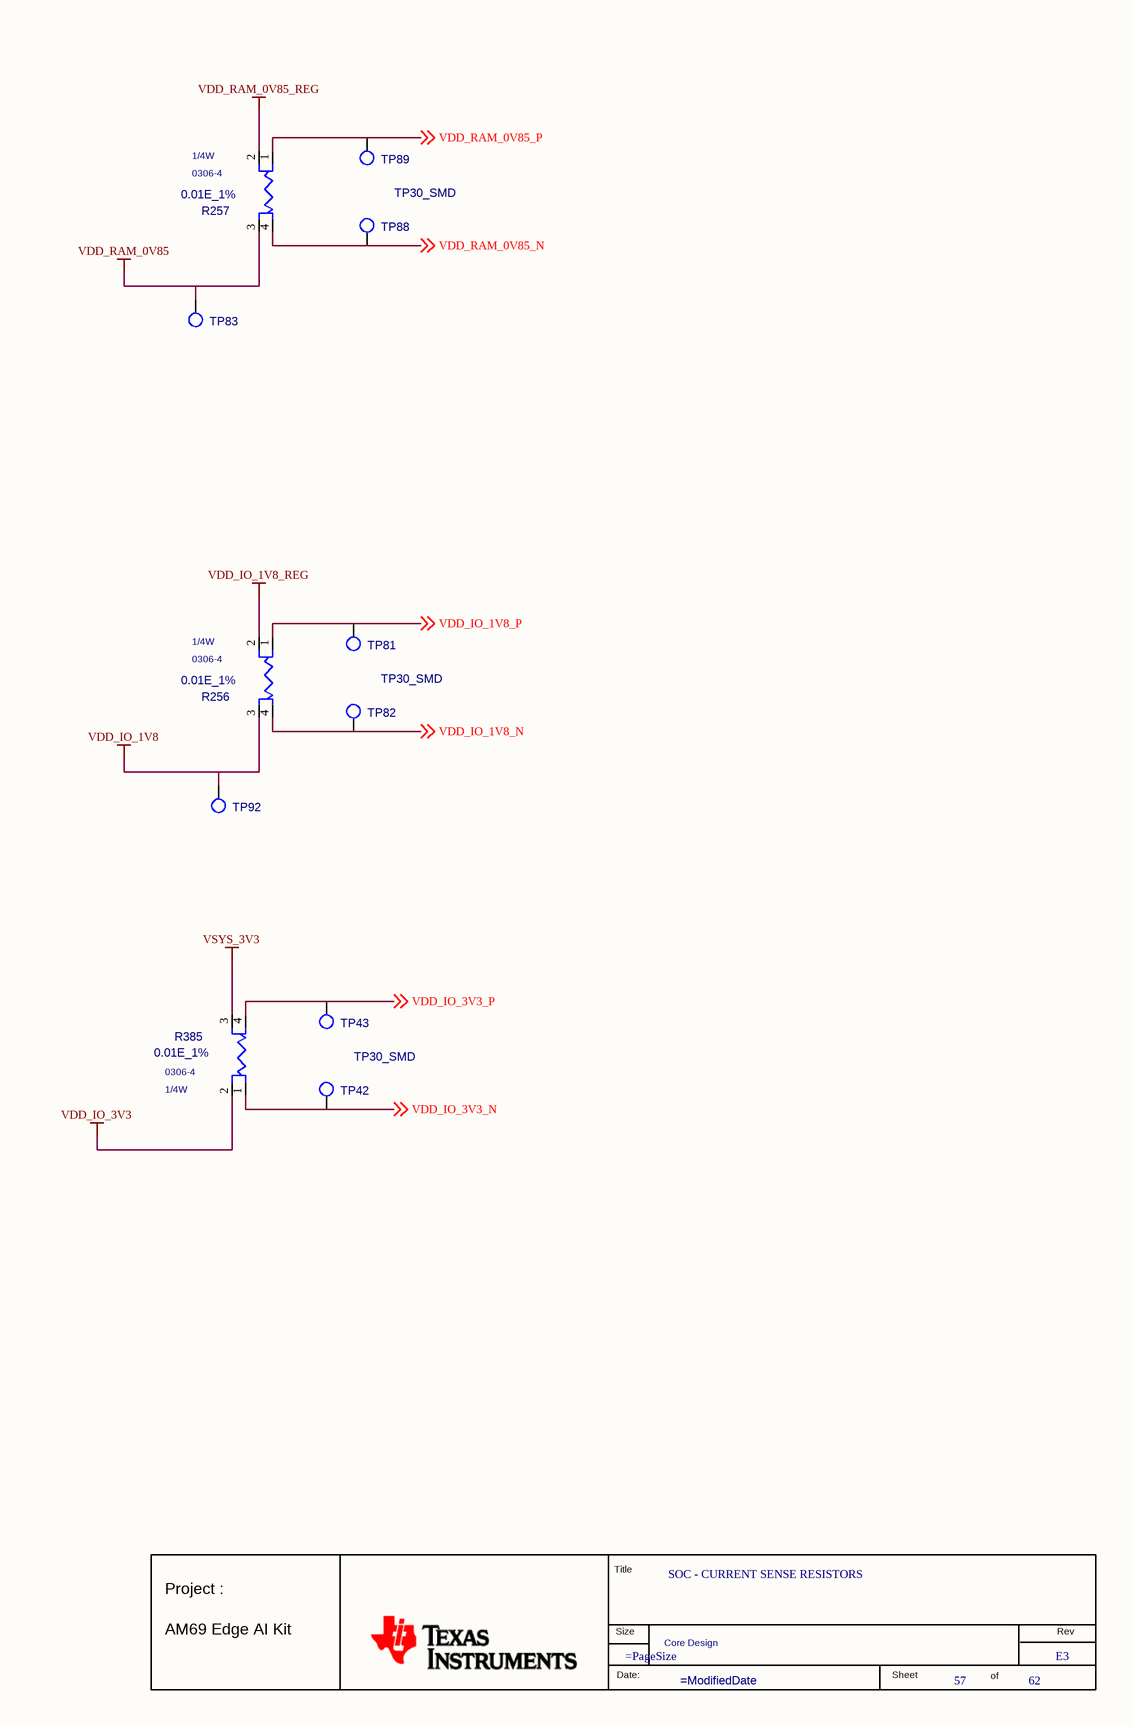
[diagram p96: 57. EVM SOC CURRENT_SENSE_RES.SchDoc, right]

### Parts
(Parts that share a designator on the sheet are numbered #1, #2 ... from top to bottom, then left to right.)
*#57  RevCode: E3  Title: SOC - CURRENT SENSE RESISTORS  Page Number: 57  Page Count: 62  Variant Name: Core Design  (hidden comment: MISTRAL_TITLEBLK_CSIZE_1)  (graphical)
R53  0.005E_1%  [RES_KRL3216_1206-6_0-7_TI]
R78  0.005E_1%  [RES_KRL3216_1206-6_0-7_TI]
R256  0.01E_1%  Wattage: 1/4W  Package: 0306-4  [RES_FC4L16_0306-4_0-7]
R257  0.01E_1%  Wattage: 1/4W  Package: 0306-4  [RES_FC4L16_0306-4_0-7]
R385  0.01E_1%  Wattage: 1/4W  Package: 0306-4  [RES_FC4L16_0306-4_0-7]
R522  0.01E_1%  Package: 0306-4  Wattage: 1/4W  [RES_FC4L16_0306-4_0-7]
TP16  TP30_SMD  [TP30_SMD]  (value not drawn)
TP18  TP30_SMD  [TP30_SMD]  (value not drawn)
TP25  TP30_SMD  [TP30_SMD]  (value not drawn)
TP26  TP30_SMD  [TP30_SMD]  (value not drawn)
TP27  TP30_SMD  [TP30_SMD]  (value not drawn)
TP30  TP30_SMD  [TP30_SMD]  (value not drawn)
TP31  TP30_SMD  [TP30_SMD]  (value not drawn)
TP42  TP30_SMD  [TP30_SMD]
TP43  TP30_SMD  [TP30_SMD]  (value not drawn)
TP56  TP30_SMD  [TP30_SMD]  (value not drawn)
TP65  TP30_SMD  [TP30_SMD]  (value not drawn)
TP66  TP30_SMD  [TP30_SMD]  (value not drawn)
TP72  TP30_SMD  [TP30_SMD]  (value not drawn)
TP74  TP30_SMD  [TP30_SMD]  (value not drawn)
TP81  TP30_SMD  [TP30_SMD]  (value not drawn)
TP82  TP30_SMD  [TP30_SMD]
TP83  TP30_SMD  [TP30_SMD]  (value not drawn)
TP88  TP30_SMD  [TP30_SMD]
TP89  TP30_SMD  [TP30_SMD]  (value not drawn)
TP92  TP30_SMD  [TP30_SMD]  (value not drawn)

### Nets
VCCA_3V3_CORE: R78.4 R78.6
VCCA_3V3_CPU_AVS: R53.4 R53.6
VCCA_3V3_DDR: R522.2
VDA_DLL_0V8: TP72.1(TP)
VDA_PLL_1V8: TP74.1(TP)  [project net VDA_MCU_1V8]
VDD_CORE_0V8: TP31.1(TP)  [project net VDD_WAKE0]
VDD_CPU_AVS: TP30.1(TP)  [project net VDD_CPU_HCPS_VOSNS]
VDD_DDR_1V1: TP56.1(TP)
VDD_IO_1V8: R256.3 TP92.1(TP)
VDD_IO_1V8_REG: R256.2
VDD_IO_3V3: R385.2  [project net VDDSHV0_MCU]
VDD_RAM_0V85: R257.3 TP83.1(TP)
VDD_RAM_0V85_REG: R257.2
VDDA_USB_3V3: TP25.1(TP)
VSYS_3V3: R53.1 R53.3 R78.1 R78.3 R385.3 R522.3  [project net V_3V3]
VCCA_3V3_CORE_N: R78.5 TP18.1(TP) ; off-sheet VCCA_3V3_CORE_N
VCCA_3V3_CORE_P: R78.2 TP16.1(TP) ; off-sheet VCCA_3V3_CORE_P
VCCA_3V3_CPU_AVS_N: R53.5 TP26.1(TP) ; off-sheet VCCA_3V3_CPU_AVS_N
VCCA_3V3_CPU_AVS_P: R53.2 TP27.1(TP) ; off-sheet VCCA_3V3_CPU_AVS_P
VCCA_3V3_DDR_N: R522.1 TP66.1(TP) ; off-sheet VCCA_3V3_DDR_N
VCCA_3V3_DDR_P: R522.4 TP65.1(TP) ; off-sheet VCCA_3V3_DDR_P
VDD_IO_1V8_N: R256.4 TP82.1(TP) ; off-sheet VDD_IO_1V8_N
VDD_IO_1V8_P: R256.1 TP81.1(TP) ; off-sheet VDD_IO_1V8_P
VDD_IO_3V3_N: R385.1 TP42.1(TP) ; off-sheet VDD_IO_3V3_N
VDD_IO_3V3_P: R385.4 TP43.1(TP) ; off-sheet VDD_IO_3V3_P
VDD_RAM_0V85_N: R257.4 TP88.1(TP) ; off-sheet VDD_RAM_0V85_N
VDD_RAM_0V85_P: R257.1 TP89.1(TP) ; off-sheet VDD_RAM_0V85_P

### Notes on the sheet
- SOC Current Sense Resistors
- CORE, AVS and DDR input supply sense
  resistors
- PCB Note: Place all SMT TPs
  on PCB top-side & on top of via at
  Bd-to-Bd connector
- (in symbol MISTRAL_TITLEBLK_CSIZE_1) Title; Project :; Size; Rev; AM69 Edge AI Kit; Date:; Sheet; of

### Library data of the parts
*#57 = MISTRAL_TITLEBLK_CSIZE_1: as *#56 on sheet 56. SOC LDOs & LD SWITCHES; Page Create Date: March  8, 1995; Page Size: =PageSize; Page Modify Date: =ModifiedDate; Schematic Page Count: 62; Schematic Page Number: 57
R53 = RESISTOR_KRL_TI: RES 0.005E 1.5W 1% 1206-W; Part Reference: R53; Part_type: RESISTORS\FIXED; Mfr_part_number: KRL3216E-C-R005-F-T1_TI; Mfr_name: SUSUMU; Mistral Part No: 110019080004-R; Custom_Duty: 15%; Customs_HS_Code: 85332119; Voltage: NA; Project: J7ES_SOM_DUAL-LEO_PMIC; Value: 0.005E_1%; Footprint Path: Y:\MIS_DATABASE\Library\ALTIUM_TOOL\PCB_FOOTPRINTS\Altium_Footprint_Lib.PcbLib; Library Path: Y:\MIS_DATABASE\Library\ALTIUM_TOOL\SCHEMATICS_PARTS\MS_DISCRETE_Library.schlib; MECHANICAL 3D STEP FILE: RES_KRL3216_1206-6_0-7_TI; Chkd/date: MANIRAJA/020819; Crtd /date: ALVY/010819; Datasheet: Y:\MIS_DATABASE\DATASHEETS\RESISTORS\KRL_TI-SERIES.PDF; Temperature: -55°C+175°C; Weight: NA; Height: 0.70MM; Library Ref: RESISTOR_KRL_TI; Distributor_part_number: 754-KRL3216ECR005FT1; Distributor_name: MOUSER; Package: 1206-W; Wattage: 1.5W; Tolerance: 1%; Footprint Ref: RES_KRL3216_1206-6_0-7_TI; PCB Footprint: RES_KRL3216_1206-6_0-7_TI
R78 = RESISTOR_KRL_TI: RES 0.005E 1.5W 1% 1206-W; Part Reference: R78; Mistral Part No: 110019080004-R; Mfr_name: SUSUMU; Mfr_part_number: KRL3216E-C-R005-F-T1_TI; Part_type: RESISTORS\FIXED; Project: J7ES_SOM_DUAL-LEO_PMIC; Voltage: NA; Customs_HS_Code: 85332119; Custom_Duty: 15%; Value: 0.005E_1%; Footprint Ref: RES_KRL3216_1206-6_0-7_TI; Tolerance: 1%; Wattage: 1.5W; Package: 1206-W; Distributor_name: MOUSER; Distributor_part_number: 754-KRL3216ECR005FT1; Library Ref: RESISTOR_KRL_TI; Height: 0.70MM; Weight: NA; Temperature: -55°C+175°C; Datasheet: Y:\MIS_DATABASE\DATASHEETS\RESISTORS\KRL_TI-SERIES.PDF; Crtd /date: ALVY/010819; Chkd/date: MANIRAJA/020819; MECHANICAL 3D STEP FILE: RES_KRL3216_1206-6_0-7_TI; Library Path: Y:\MIS_DATABASE\Library\ALTIUM_TOOL\SCHEMATICS_PARTS\MS_DISCRETE_Library.schlib; Footprint Path: Y:\MIS_DATABASE\Library\ALTIUM_TOOL\PCB_FOOTPRINTS\Altium_Footprint_Lib.PcbLib; PCB Footprint: RES_KRL3216_1206-6_0-7_TI
R256 = RESISTOR-4TERM: RES CURRENT SENSE 0.01E 1/4W 1% 0306-4; Part Reference: R256; Mistral Part No: 110018100017-R; Mfr_name: OHMITE; Mfr_part_number: FC4L16R010FER; Part_type: RESISTORS\FIXED; Project: TI_J7ES_EVM_SOM; Voltage: NA; Customs_HS_Code: 85332119; Custom_Duty: 15%; Value: 0.01E_1%; PCB Footprint: RES_FC4L16_0306-4_0-7; Footprint Ref: RES_FC4L16_0306-4_0-7; Tolerance: 1%; Distributor_name: DIGIKEY; Distributor_part_number: FC4L16R010FERCT-ND; Library Ref: RESISTOR-4TERM; Height: 0.70MM; Weight: 4mg; Temperature: -40°C+125°C; Datasheet: Y:\MIS_DATABASE\DATASHEETS\RESISTORS\FC4L-SERIES.PDF; Crtd /date: ALVY/261018; Chkd/date: MANIRAJA/261018; MECHANICAL 3D STEP FILE: RES_FC4L16_0306-4_0-7; Library Path: Y:\MIS_DATABASE\Library\ALTIUM_TOOL\SCHEMATICS_PARTS\MS_DISCRETE_Library.schlib; Footprint Path: Y:\MIS_DATABASE\Library\ALTIUM_TOOL\PCB_FOOTPRINTS\Altium_Footprint_Lib.PcbLib; Manufacturer: OHMITE
R257 = RESISTOR-4TERM: RES CURRENT SENSE 0.01E 1/4W 1% 0306-4; Part Reference: R257; Manufacturer: OHMITE; Mistral Part No: 110018100017-R; Mfr_part_number: FC4L16R010FER; Part_type: RESISTORS\FIXED; Project: TI_J7ES_EVM_SOM; Voltage: NA; Customs_HS_Code: 85332119; Custom_Duty: 15%; Value: 0.01E_1%; PCB Footprint: RES_FC4L16_0306-4_0-7; Footprint Ref: RES_FC4L16_0306-4_0-7; Mfr_name: OHMITE; Tolerance: 1%; Distributor_name: DIGIKEY; Distributor_part_number: FC4L16R010FERCT-ND; Library Ref: RESISTOR-4TERM; Height: 0.70MM; Weight: 4mg; Temperature: -40°C+125°C; Datasheet: Y:\MIS_DATABASE\DATASHEETS\RESISTORS\FC4L-SERIES.PDF; Crtd /date: ALVY/261018; Chkd/date: MANIRAJA/261018; MECHANICAL 3D STEP FILE: RES_FC4L16_0306-4_0-7; Library Path: Y:\MIS_DATABASE\Library\ALTIUM_TOOL\SCHEMATICS_PARTS\MS_DISCRETE_Library.schlib; Footprint Path: Y:\MIS_DATABASE\Library\ALTIUM_TOOL\PCB_FOOTPRINTS\Altium_Footprint_Lib.PcbLib
R385 = RESISTOR-4TERM: RES CURRENT SENSE 0.01E 1/4W 1% 0306-4; Part Reference: R385; Manufacturer: OHMITE; Mistral Part No: 110018100017-R; Mfr_part_number: FC4L16R010FER; Part_type: RESISTORS\FIXED; Project: TI_J7ES_EVM_SOM; Voltage: NA; Customs_HS_Code: 85332119; Custom_Duty: 15%; Value: 0.01E_1%; PCB Footprint: RES_FC4L16_0306-4_0-7; Footprint Ref: RES_FC4L16_0306-4_0-7; Mfr_name: OHMITE; Tolerance: 1%; Distributor_name: DIGIKEY; Distributor_part_number: FC4L16R010FERCT-ND; Library Ref: RESISTOR-4TERM; Height: 0.70MM; Weight: 4mg; Temperature: -40°C+125°C; Datasheet: Y:\MIS_DATABASE\DATASHEETS\RESISTORS\FC4L-SERIES.PDF; Crtd /date: ALVY/261018; Chkd/date: MANIRAJA/261018; MECHANICAL 3D STEP FILE: RES_FC4L16_0306-4_0-7; Library Path: Y:\MIS_DATABASE\Library\ALTIUM_TOOL\SCHEMATICS_PARTS\MS_DISCRETE_Library.schlib; Footprint Path: Y:\MIS_DATABASE\Library\ALTIUM_TOOL\PCB_FOOTPRINTS\Altium_Footprint_Lib.PcbLib
R522 = RESISTOR-4TERM: RES CURRENT SENSE 0.01E 1/4W 1% 0306-4; Part Reference: R522; Part_type: RESISTORS\FIXED; Mfr_part_number: FC4L16R010FER; Mfr_name: OHMITE; Mistral Part No: 110018100017-R; Custom_Duty: 15%; Customs_HS_Code: 85332119; Voltage: NA; Project: TI_J7ES_EVM_SOM; Value: 0.01E_1%; Footprint Path: Y:\MIS_DATABASE\Library\ALTIUM_TOOL\PCB_FOOTPRINTS\Altium_Footprint_Lib.PcbLib; Library Path: Y:\MIS_DATABASE\Library\ALTIUM_TOOL\SCHEMATICS_PARTS\MS_DISCRETE_Library.schlib; MECHANICAL 3D STEP FILE: RES_FC4L16_0306-4_0-7; Chkd/date: MANIRAJA/261018; Crtd /date: ALVY/261018; Datasheet: Y:\MIS_DATABASE\DATASHEETS\RESISTORS\FC4L-SERIES.PDF; Temperature: -40°C+125°C; Weight: 4mg; Height: 0.70MM; Library Ref: RESISTOR-4TERM; Distributor_part_number: FC4L16R010FERCT-ND; Distributor_name: DIGIKEY; Tolerance: 1%; Footprint Ref: RES_FC4L16_0306-4_0-7; Manufacturer: OHMITE; PCB Footprint: RES_FC4L16_0306-4_0-7
TP16 = TESTPOINT_Dup1: TESTPOINT CIR 30 SMD; Part Reference: TP16; Manufacturer: LOCAL; Mistral Part No: 130009030930; Project: BT MODULE_CSRBC04; Tolerance: NA; Value: TP30_SMD; Footprint Ref: TP30_SMD; Mfr_name: LOCAL; Mfr_part_number: TP30_SMD; Part_type: TESTPOINT; Voltage: NA; Wattage: NA; Package: SMD; Distributor_name: NA; Distributor_part_number: NA; Library Ref: TESTPOINT; Height: NA; Weight: NA; Temperature: NA; Datasheet: NA; Crtd /date: MAZHAR/171006; Chkd/date: SHREESHAIL/171006; RoHS: NA; Customs_HS_Code: NA; Custom_Duty: NA; MECHANICAL 3D STEP FILE: NA; Library Path: Y:\MIS_DATABASE\Library\ALTIUM_TOOL\SCHEMATICS_PARTS\MS_DISCRETE_Library.schlib; Footprint Path: Y:\MIS_DATABASE\Library\ALTIUM_TOOL\PCB_FOOTPRINTS\Altium_Footprint_Lib.PcbLib; PCB Footprint: TP30_SMD
TP18 = TESTPOINT_Dup1: TESTPOINT CIR 30 SMD; Part Reference: TP18; Manufacturer: LOCAL; Mistral Part No: 130009030930; Project: BT MODULE_CSRBC04; Tolerance: NA; Value: TP30_SMD; Footprint Ref: TP30_SMD; Mfr_name: LOCAL; Mfr_part_number: TP30_SMD; Part_type: TESTPOINT; Voltage: NA; Wattage: NA; Package: SMD; Distributor_name: NA; Distributor_part_number: NA; Library Ref: TESTPOINT; Height: NA; Weight: NA; Temperature: NA; Datasheet: NA; Crtd /date: MAZHAR/171006; Chkd/date: SHREESHAIL/171006; RoHS: NA; Customs_HS_Code: NA; Custom_Duty: NA; MECHANICAL 3D STEP FILE: NA; Library Path: Y:\MIS_DATABASE\Library\ALTIUM_TOOL\SCHEMATICS_PARTS\MS_DISCRETE_Library.schlib; Footprint Path: Y:\MIS_DATABASE\Library\ALTIUM_TOOL\PCB_FOOTPRINTS\Altium_Footprint_Lib.PcbLib; PCB Footprint: TP30_SMD
TP25 = TESTPOINT_Dup1: TESTPOINT CIR 30 SMD; Part Reference: TP25; Manufacturer: LOCAL; Mistral Part No: 130009030930; MECHANICAL 3D STEP FILE: NA; Project: BT MODULE_CSRBC04; Value: TP30_SMD; PCB Footprint: TP30_SMD; Footprint Path: Y:\MIS_DATABASE\Library\ALTIUM_TOOL\PCB_FOOTPRINTS\Altium_Footprint_Lib.PcbLib; Library Path: Y:\MIS_DATABASE\Library\ALTIUM_TOOL\SCHEMATICS_PARTS\MS_DISCRETE_Library.schlib; Custom_Duty: NA; Customs_HS_Code: NA; RoHS: NA; Chkd/date: SHREESHAIL/171006; Crtd /date: MAZHAR/171006; Datasheet: NA; Temperature: NA; Weight: NA; Height: NA; Library Ref: TESTPOINT; Distributor_part_number: NA; Distributor_name: NA; Package: SMD; Wattage: NA; Voltage: NA; Tolerance: NA; Part_type: TESTPOINT; Mfr_part_number: TP30_SMD; Mfr_name: LOCAL; Footprint Ref: TP30_SMD
TP26 = TESTPOINT_Dup1: TESTPOINT CIR 30 SMD; Part Reference: TP26; Mfr_name: LOCAL; Mistral Part No: 130009030930; MECHANICAL 3D STEP FILE: NA; Project: BT MODULE_CSRBC04; Value: TP30_SMD; Footprint Path: Y:\MIS_DATABASE\Library\ALTIUM_TOOL\PCB_FOOTPRINTS\Altium_Footprint_Lib.PcbLib; Library Path: Y:\MIS_DATABASE\Library\ALTIUM_TOOL\SCHEMATICS_PARTS\MS_DISCRETE_Library.schlib; Custom_Duty: NA; Customs_HS_Code: NA; RoHS: NA; Chkd/date: SHREESHAIL/171006; Crtd /date: MAZHAR/171006; Datasheet: NA; Temperature: NA; Weight: NA; Height: NA; Library Ref: TESTPOINT; Distributor_part_number: NA; Distributor_name: NA; Package: SMD; Wattage: NA; Voltage: NA; Tolerance: NA; Part_type: TESTPOINT; Mfr_part_number: TP30_SMD; Footprint Ref: TP30_SMD; Manufacturer: LOCAL; PCB Footprint: TP30_SMD
TP27 = TESTPOINT_Dup1: TESTPOINT CIR 30 SMD; Part Reference: TP27; Mfr_name: LOCAL; Mistral Part No: 130009030930; MECHANICAL 3D STEP FILE: NA; Project: BT MODULE_CSRBC04; Value: TP30_SMD; Footprint Path: Y:\MIS_DATABASE\Library\ALTIUM_TOOL\PCB_FOOTPRINTS\Altium_Footprint_Lib.PcbLib; Library Path: Y:\MIS_DATABASE\Library\ALTIUM_TOOL\SCHEMATICS_PARTS\MS_DISCRETE_Library.schlib; Custom_Duty: NA; Customs_HS_Code: NA; RoHS: NA; Chkd/date: SHREESHAIL/171006; Crtd /date: MAZHAR/171006; Datasheet: NA; Temperature: NA; Weight: NA; Height: NA; Library Ref: TESTPOINT; Distributor_part_number: NA; Distributor_name: NA; Package: SMD; Wattage: NA; Voltage: NA; Tolerance: NA; Part_type: TESTPOINT; Mfr_part_number: TP30_SMD; Footprint Ref: TP30_SMD; Manufacturer: LOCAL; PCB Footprint: TP30_SMD
TP30 = TESTPOINT_Dup1: TESTPOINT CIR 30 SMD; Part Reference: TP30; Mistral Part No: 130009030930; Mfr_name: LOCAL; Project: BT MODULE_CSRBC04; Tolerance: NA; Value: TP30_SMD; Footprint Ref: TP30_SMD; Mfr_part_number: TP30_SMD; Part_type: TESTPOINT; Voltage: NA; Wattage: NA; Package: SMD; Distributor_name: NA; Distributor_part_number: NA; Library Ref: TESTPOINT; Height: NA; Weight: NA; Temperature: NA; Datasheet: NA; Crtd /date: MAZHAR/171006; Chkd/date: SHREESHAIL/171006; RoHS: NA; Customs_HS_Code: NA; Custom_Duty: NA; MECHANICAL 3D STEP FILE: NA; Library Path: Y:\MIS_DATABASE\Library\ALTIUM_TOOL\SCHEMATICS_PARTS\MS_DISCRETE_Library.schlib; Footprint Path: Y:\MIS_DATABASE\Library\ALTIUM_TOOL\PCB_FOOTPRINTS\Altium_Footprint_Lib.PcbLib; Manufacturer: LOCAL; PCB Footprint: TP30_SMD
TP31 = TESTPOINT_Dup1: TESTPOINT CIR 30 SMD; Part Reference: TP31; Manufacturer: LOCAL; Mistral Part No: 130009030930; MECHANICAL 3D STEP FILE: NA; Project: BT MODULE_CSRBC04; Value: TP30_SMD; Footprint Path: Y:\MIS_DATABASE\Library\ALTIUM_TOOL\PCB_FOOTPRINTS\Altium_Footprint_Lib.PcbLib; Library Path: Y:\MIS_DATABASE\Library\ALTIUM_TOOL\SCHEMATICS_PARTS\MS_DISCRETE_Library.schlib; Custom_Duty: NA; Customs_HS_Code: NA; RoHS: NA; Chkd/date: SHREESHAIL/171006; Crtd /date: MAZHAR/171006; Datasheet: NA; Temperature: NA; Weight: NA; Height: NA; Library Ref: TESTPOINT; Distributor_part_number: NA; Distributor_name: NA; Package: SMD; Wattage: NA; Voltage: NA; Tolerance: NA; Part_type: TESTPOINT; Mfr_part_number: TP30_SMD; Mfr_name: LOCAL; Footprint Ref: TP30_SMD; PCB Footprint: TP30_SMD
TP42 = TESTPOINT_Dup1: TESTPOINT CIR 30 SMD; Part Reference: TP42; Manufacturer: LOCAL; Mistral Part No: 130009030930; MECHANICAL 3D STEP FILE: NA; Project: BT MODULE_CSRBC04; Value: TP30_SMD; PCB Footprint: TP30_SMD; Footprint Path: Y:\MIS_DATABASE\Library\ALTIUM_TOOL\PCB_FOOTPRINTS\Altium_Footprint_Lib.PcbLib; Library Path: Y:\MIS_DATABASE\Library\ALTIUM_TOOL\SCHEMATICS_PARTS\MS_DISCRETE_Library.schlib; Custom_Duty: NA; Customs_HS_Code: NA; RoHS: NA; Chkd/date: SHREESHAIL/171006; Crtd /date: MAZHAR/171006; Datasheet: NA; Temperature: NA; Weight: NA; Height: NA; Library Ref: TESTPOINT; Distributor_part_number: NA; Distributor_name: NA; Package: SMD; Wattage: NA; Voltage: NA; Tolerance: NA; Part_type: TESTPOINT; Mfr_part_number: TP30_SMD; Mfr_name: LOCAL; Footprint Ref: TP30_SMD
TP43 = TESTPOINT_Dup1: TESTPOINT CIR 30 SMD; Part Reference: TP43; Manufacturer: LOCAL; Mistral Part No: 130009030930; MECHANICAL 3D STEP FILE: NA; Project: BT MODULE_CSRBC04; Value: TP30_SMD; PCB Footprint: TP30_SMD; Footprint Path: Y:\MIS_DATABASE\Library\ALTIUM_TOOL\PCB_FOOTPRINTS\Altium_Footprint_Lib.PcbLib; Library Path: Y:\MIS_DATABASE\Library\ALTIUM_TOOL\SCHEMATICS_PARTS\MS_DISCRETE_Library.schlib; Custom_Duty: NA; Customs_HS_Code: NA; RoHS: NA; Chkd/date: SHREESHAIL/171006; Crtd /date: MAZHAR/171006; Datasheet: NA; Temperature: NA; Weight: NA; Height: NA; Library Ref: TESTPOINT; Distributor_part_number: NA; Distributor_name: NA; Package: SMD; Wattage: NA; Voltage: NA; Tolerance: NA; Part_type: TESTPOINT; Mfr_part_number: TP30_SMD; Mfr_name: LOCAL; Footprint Ref: TP30_SMD
TP56 = TESTPOINT_Dup1: TESTPOINT CIR 30 SMD; Part Reference: TP56; Manufacturer: LOCAL; Mistral Part No: 130009030930; MECHANICAL 3D STEP FILE: NA; Project: BT MODULE_CSRBC04; Value: TP30_SMD; PCB Footprint: TP30_SMD; Footprint Path: Y:\MIS_DATABASE\Library\ALTIUM_TOOL\PCB_FOOTPRINTS\Altium_Footprint_Lib.PcbLib; Library Path: Y:\MIS_DATABASE\Library\ALTIUM_TOOL\SCHEMATICS_PARTS\MS_DISCRETE_Library.schlib; Custom_Duty: NA; Customs_HS_Code: NA; RoHS: NA; Chkd/date: SHREESHAIL/171006; Crtd /date: MAZHAR/171006; Datasheet: NA; Temperature: NA; Weight: NA; Height: NA; Library Ref: TESTPOINT; Distributor_part_number: NA; Distributor_name: NA; Package: SMD; Wattage: NA; Voltage: NA; Tolerance: NA; Part_type: TESTPOINT; Mfr_part_number: TP30_SMD; Mfr_name: LOCAL; Footprint Ref: TP30_SMD
TP65 = TESTPOINT_Dup1: TESTPOINT CIR 30 SMD; Part Reference: TP65; Manufacturer: LOCAL; Mistral Part No: 130009030930; Project: BT MODULE_CSRBC04; Tolerance: NA; Value: TP30_SMD; Footprint Ref: TP30_SMD; Mfr_name: LOCAL; Mfr_part_number: TP30_SMD; Part_type: TESTPOINT; Voltage: NA; Wattage: NA; Package: SMD; Distributor_name: NA; Distributor_part_number: NA; Library Ref: TESTPOINT; Height: NA; Weight: NA; Temperature: NA; Datasheet: NA; Crtd /date: MAZHAR/171006; Chkd/date: SHREESHAIL/171006; RoHS: NA; Customs_HS_Code: NA; Custom_Duty: NA; MECHANICAL 3D STEP FILE: NA; Library Path: Y:\MIS_DATABASE\Library\ALTIUM_TOOL\SCHEMATICS_PARTS\MS_DISCRETE_Library.schlib; Footprint Path: Y:\MIS_DATABASE\Library\ALTIUM_TOOL\PCB_FOOTPRINTS\Altium_Footprint_Lib.PcbLib; PCB Footprint: TP30_SMD
TP66 = TESTPOINT_Dup1: TESTPOINT CIR 30 SMD; Part Reference: TP66; Manufacturer: LOCAL; Mistral Part No: 130009030930; Project: BT MODULE_CSRBC04; Tolerance: NA; Value: TP30_SMD; Footprint Ref: TP30_SMD; Mfr_name: LOCAL; Mfr_part_number: TP30_SMD; Part_type: TESTPOINT; Voltage: NA; Wattage: NA; Package: SMD; Distributor_name: NA; Distributor_part_number: NA; Library Ref: TESTPOINT; Height: NA; Weight: NA; Temperature: NA; Datasheet: NA; Crtd /date: MAZHAR/171006; Chkd/date: SHREESHAIL/171006; RoHS: NA; Customs_HS_Code: NA; Custom_Duty: NA; MECHANICAL 3D STEP FILE: NA; Library Path: Y:\MIS_DATABASE\Library\ALTIUM_TOOL\SCHEMATICS_PARTS\MS_DISCRETE_Library.schlib; Footprint Path: Y:\MIS_DATABASE\Library\ALTIUM_TOOL\PCB_FOOTPRINTS\Altium_Footprint_Lib.PcbLib; PCB Footprint: TP30_SMD
TP72 = TESTPOINT_Dup1: TESTPOINT CIR 30 SMD; Part Reference: TP72; Manufacturer: LOCAL; Mistral Part No: 130009030930; MECHANICAL 3D STEP FILE: NA; Project: BT MODULE_CSRBC04; Value: TP30_SMD; Footprint Path: Y:\MIS_DATABASE\Library\ALTIUM_TOOL\PCB_FOOTPRINTS\Altium_Footprint_Lib.PcbLib; Library Path: Y:\MIS_DATABASE\Library\ALTIUM_TOOL\SCHEMATICS_PARTS\MS_DISCRETE_Library.schlib; Custom_Duty: NA; Customs_HS_Code: NA; RoHS: NA; Chkd/date: SHREESHAIL/171006; Crtd /date: MAZHAR/171006; Datasheet: NA; Temperature: NA; Weight: NA; Height: NA; Library Ref: TESTPOINT; Distributor_part_number: NA; Distributor_name: NA; Package: SMD; Wattage: NA; Voltage: NA; Tolerance: NA; Part_type: TESTPOINT; Mfr_part_number: TP30_SMD; Mfr_name: LOCAL; Footprint Ref: TP30_SMD; PCB Footprint: TP30_SMD
TP74 = TESTPOINT_Dup1: TESTPOINT CIR 30 SMD; Part Reference: TP74; Manufacturer: LOCAL; Mistral Part No: 130009030930; MECHANICAL 3D STEP FILE: NA; Project: BT MODULE_CSRBC04; Value: TP30_SMD; Footprint Path: Y:\MIS_DATABASE\Library\ALTIUM_TOOL\PCB_FOOTPRINTS\Altium_Footprint_Lib.PcbLib; Library Path: Y:\MIS_DATABASE\Library\ALTIUM_TOOL\SCHEMATICS_PARTS\MS_DISCRETE_Library.schlib; Custom_Duty: NA; Customs_HS_Code: NA; RoHS: NA; Chkd/date: SHREESHAIL/171006; Crtd /date: MAZHAR/171006; Datasheet: NA; Temperature: NA; Weight: NA; Height: NA; Library Ref: TESTPOINT; Distributor_part_number: NA; Distributor_name: NA; Package: SMD; Wattage: NA; Voltage: NA; Tolerance: NA; Part_type: TESTPOINT; Mfr_part_number: TP30_SMD; Mfr_name: LOCAL; Footprint Ref: TP30_SMD; PCB Footprint: TP30_SMD
TP81 = TESTPOINT_Dup1: TESTPOINT CIR 30 SMD; Part Reference: TP81; Mistral Part No: 130009030930; Mfr_name: LOCAL; Project: BT MODULE_CSRBC04; Tolerance: NA; Value: TP30_SMD; PCB Footprint: TP30_SMD; Footprint Ref: TP30_SMD; Mfr_part_number: TP30_SMD; Part_type: TESTPOINT; Voltage: NA; Wattage: NA; Package: SMD; Distributor_name: NA; Distributor_part_number: NA; Library Ref: TESTPOINT; Height: NA; Weight: NA; Temperature: NA; Datasheet: NA; Crtd /date: MAZHAR/171006; Chkd/date: SHREESHAIL/171006; RoHS: NA; Customs_HS_Code: NA; Custom_Duty: NA; MECHANICAL 3D STEP FILE: NA; Library Path: Y:\MIS_DATABASE\Library\ALTIUM_TOOL\SCHEMATICS_PARTS\MS_DISCRETE_Library.schlib; Footprint Path: Y:\MIS_DATABASE\Library\ALTIUM_TOOL\PCB_FOOTPRINTS\Altium_Footprint_Lib.PcbLib; Manufacturer: LOCAL
TP82 = TESTPOINT_Dup1: TESTPOINT CIR 30 SMD; Part Reference: TP82; Mistral Part No: 130009030930; Mfr_name: LOCAL; Project: BT MODULE_CSRBC04; Tolerance: NA; Value: TP30_SMD; PCB Footprint: TP30_SMD; Footprint Ref: TP30_SMD; Mfr_part_number: TP30_SMD; Part_type: TESTPOINT; Voltage: NA; Wattage: NA; Package: SMD; Distributor_name: NA; Distributor_part_number: NA; Library Ref: TESTPOINT; Height: NA; Weight: NA; Temperature: NA; Datasheet: NA; Crtd /date: MAZHAR/171006; Chkd/date: SHREESHAIL/171006; RoHS: NA; Customs_HS_Code: NA; Custom_Duty: NA; MECHANICAL 3D STEP FILE: NA; Library Path: Y:\MIS_DATABASE\Library\ALTIUM_TOOL\SCHEMATICS_PARTS\MS_DISCRETE_Library.schlib; Footprint Path: Y:\MIS_DATABASE\Library\ALTIUM_TOOL\PCB_FOOTPRINTS\Altium_Footprint_Lib.PcbLib; Manufacturer: LOCAL
TP83 = TESTPOINT_Dup1: TESTPOINT CIR 30 SMD; Part Reference: TP83; Manufacturer: LOCAL; Mistral Part No: 130009030930; MECHANICAL 3D STEP FILE: NA; Project: BT MODULE_CSRBC04; Value: TP30_SMD; PCB Footprint: TP30_SMD; Footprint Path: Y:\MIS_DATABASE\Library\ALTIUM_TOOL\PCB_FOOTPRINTS\Altium_Footprint_Lib.PcbLib; Library Path: Y:\MIS_DATABASE\Library\ALTIUM_TOOL\SCHEMATICS_PARTS\MS_DISCRETE_Library.schlib; Custom_Duty: NA; Customs_HS_Code: NA; RoHS: NA; Chkd/date: SHREESHAIL/171006; Crtd /date: MAZHAR/171006; Datasheet: NA; Temperature: NA; Weight: NA; Height: NA; Library Ref: TESTPOINT; Distributor_part_number: NA; Distributor_name: NA; Package: SMD; Wattage: NA; Voltage: NA; Tolerance: NA; Part_type: TESTPOINT; Mfr_part_number: TP30_SMD; Mfr_name: LOCAL; Footprint Ref: TP30_SMD
TP88 = TESTPOINT_Dup1: TESTPOINT CIR 30 SMD; Part Reference: TP88; Manufacturer: LOCAL; Mistral Part No: 130009030930; Project: BT MODULE_CSRBC04; Tolerance: NA; Value: TP30_SMD; PCB Footprint: TP30_SMD; Footprint Ref: TP30_SMD; Mfr_name: LOCAL; Mfr_part_number: TP30_SMD; Part_type: TESTPOINT; Voltage: NA; Wattage: NA; Package: SMD; Distributor_name: NA; Distributor_part_number: NA; Library Ref: TESTPOINT; Height: NA; Weight: NA; Temperature: NA; Datasheet: NA; Crtd /date: MAZHAR/171006; Chkd/date: SHREESHAIL/171006; RoHS: NA; Customs_HS_Code: NA; Custom_Duty: NA; MECHANICAL 3D STEP FILE: NA; Library Path: Y:\MIS_DATABASE\Library\ALTIUM_TOOL\SCHEMATICS_PARTS\MS_DISCRETE_Library.schlib; Footprint Path: Y:\MIS_DATABASE\Library\ALTIUM_TOOL\PCB_FOOTPRINTS\Altium_Footprint_Lib.PcbLib
TP89 = TESTPOINT_Dup1: TESTPOINT CIR 30 SMD; Part Reference: TP89; Manufacturer: LOCAL; Mistral Part No: 130009030930; Project: BT MODULE_CSRBC04; Tolerance: NA; Value: TP30_SMD; PCB Footprint: TP30_SMD; Footprint Ref: TP30_SMD; Mfr_name: LOCAL; Mfr_part_number: TP30_SMD; Part_type: TESTPOINT; Voltage: NA; Wattage: NA; Package: SMD; Distributor_name: NA; Distributor_part_number: NA; Library Ref: TESTPOINT; Height: NA; Weight: NA; Temperature: NA; Datasheet: NA; Crtd /date: MAZHAR/171006; Chkd/date: SHREESHAIL/171006; RoHS: NA; Customs_HS_Code: NA; Custom_Duty: NA; MECHANICAL 3D STEP FILE: NA; Library Path: Y:\MIS_DATABASE\Library\ALTIUM_TOOL\SCHEMATICS_PARTS\MS_DISCRETE_Library.schlib; Footprint Path: Y:\MIS_DATABASE\Library\ALTIUM_TOOL\PCB_FOOTPRINTS\Altium_Footprint_Lib.PcbLib
TP92 = TESTPOINT_Dup1: TESTPOINT CIR 30 SMD; Part Reference: TP92; Mistral Part No: 130009030930; Mfr_name: LOCAL; Project: BT MODULE_CSRBC04; Tolerance: NA; Value: TP30_SMD; PCB Footprint: TP30_SMD; Footprint Ref: TP30_SMD; Mfr_part_number: TP30_SMD; Part_type: TESTPOINT; Voltage: NA; Wattage: NA; Package: SMD; Distributor_name: NA; Distributor_part_number: NA; Library Ref: TESTPOINT; Height: NA; Weight: NA; Temperature: NA; Datasheet: NA; Crtd /date: MAZHAR/171006; Chkd/date: SHREESHAIL/171006; RoHS: NA; Customs_HS_Code: NA; Custom_Duty: NA; MECHANICAL 3D STEP FILE: NA; Library Path: Y:\MIS_DATABASE\Library\ALTIUM_TOOL\SCHEMATICS_PARTS\MS_DISCRETE_Library.schlib; Footprint Path: Y:\MIS_DATABASE\Library\ALTIUM_TOOL\PCB_FOOTPRINTS\Altium_Footprint_Lib.PcbLib; Manufacturer: LOCAL